# EAGLE design Single_Board (EAGLE 9.5.2)
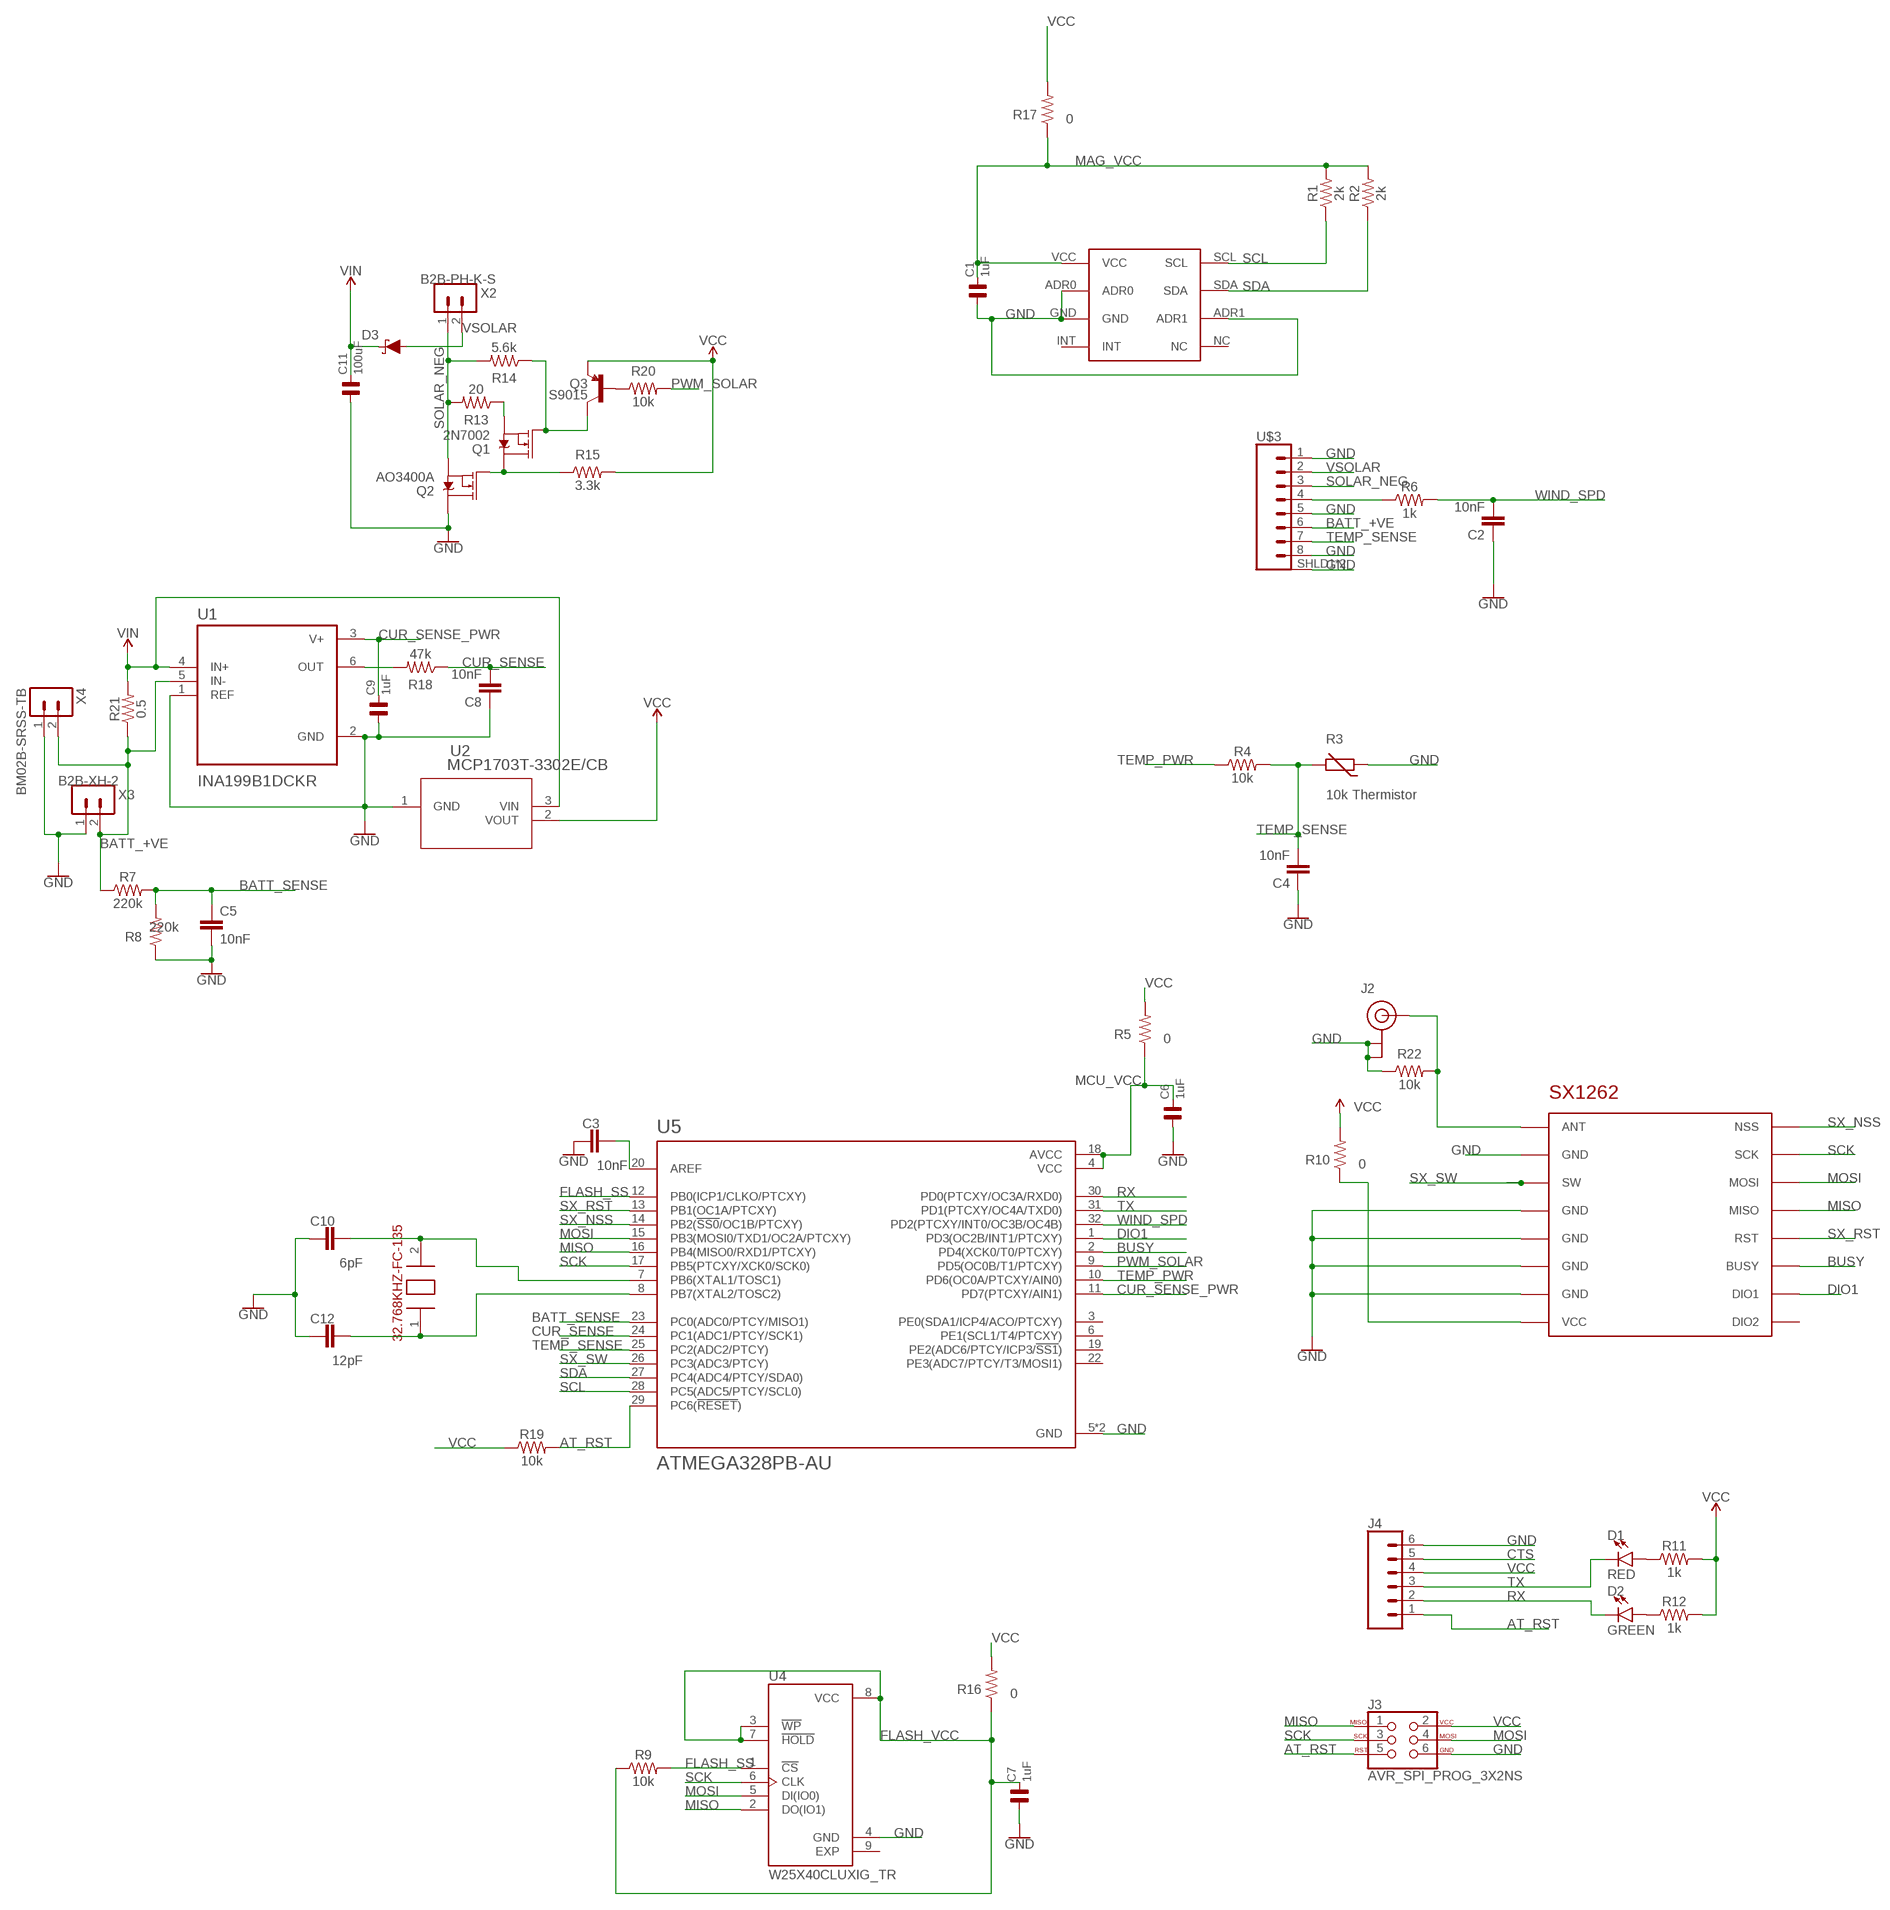
[diagram p0: schematic, sheet 1]

## Parts
C1  1uF  C0805  [0805]
C2  10nF  10NF-0603-50V-10%  [0603]
C3  10nF  10NF-0603-50V-10%  [0603]
C4  10nF  10NF-0603-50V-10%  [0603]
C5  10nF  10NF-0603-50V-10%  [0603]
C6  1uF  C0805  [0805]
C7  1uF  C0805  [0805]
C8  10nF  10NF-0603-50V-10%  [0603]
C9  1uF  C0805  [0805]
C10  6pF  10NF-0603-50V-10%  [0603]
C11  100uF  C1206  [1206]
C12  12pF  10NF-0603-50V-10%  [0603]
D1  RED  LED-RED1206  [LED-1206]
D2  GREEN  LED-GREEN1206  [LED-1206]
D3  NSR0240HT1G  DIODE-SCHOTTKY-PMEG4005EJ  [SOD-323]
J2  U.FL  [U.FL]
J3  AVR_SPI_PROG_3X2NS  [2X3-NS]
J4  CONN_06NO_SILK_FEMALE_PTH  [1X06_NO_SILK]
Q1  2N7002  MOSFET-NCH-BSS138  [SOT23-3]
Q2  AO3400A  MOSFET-NCH-BSS138  [SOT23-3]
Q3  S9015  TRANS_PNP-MMBT4403  [SOT23-3]
R1  2k  RESISTOR0805  [0805]
R2  2k  RESISTOR0805  [0805]
R3  10k Thermistor  THERMISTOR-5  [R-5]
R4  10k  RESISTOR0805  [0805]
R5  0  RESISTOR0805  [0805]
R6  1k  RESISTOR0805  [0805]
R7  220k  RESISTOR0805  [0805]
R8  220k  RESISTOR0805  [0805]
R9  10k  RESISTOR0805  [0805]
R10  0  RESISTOR0805  [0805]
R11  1k  RESISTOR0805  [0805]
R12  1k  RESISTOR0805  [0805]
R13  20  RESISTOR0805  [0805]
R14  5.6k  RESISTOR0805  [0805]
R15  3.3k  RESISTOR0805  [0805]
R16  0  RESISTOR0805  [0805]
R17  0  RESISTOR0805  [0805]
R18  47k  RESISTOR0805  [0805]
R19  10k  RESISTOR0805  [0805]
R20  10k  RESISTOR0805  [0805]
R21  0.5  RESISTOR1206  [1206]
R22  10k  RESISTOR0805  [0805]
U1  INA199B1DCKR  INA199A3DCKR  [SOT65P210X110-6N]
U2  MCP1703T-3302E/CB  [SOT-23A_MC]
U4  W25X40CLUXIG_TR  [PSON50P300X200X60-9N]
U5  ATMEGA328PB-AU  [QFP80P900X900X120-32N]
U$1  ALS31313  [ALS31313-500]
U$2  SX1262  [SX1262]
U$3  RJSHE3380  [RJHSE-3380]
X1  32.768KHZ-FC-135  [32.768KHZ-FC-135]
X2  B2B-PH-K-S  [B2B-PH-K-S]
X3  B2B-XH-2  [B2B-XH-A]
X4  BM02B-SRSS-TB  [BM02B-SRSS-TB]

## Nets
ANT: J2.FEED(SIGNAL) R22.2 U$2.ANT
AT_RST: J3.5 J4.1 R19.2 U5.29(PC6(!RESET!))
BATT_+VE: R7.1 R21.1 U1.5(IN-) U$3.6 X3.2 X4.2
BATT_SENSE: C5.1 R7.2 R8.2 U5.23(PC0(ADC0/PTCY/MISO1))
BUSY: U5.2(PD4(XCK0/T0/PTCXY)) U$2.BUSY
CTS: J4.5
CUR_SENSE: C8.2 R18.1 U5.24(PC1(ADC1/PTCY/SCK1))
CUR_SENSE_PWR: C9.2 U1.3(V+) U5.11(PD7(PTCXY/AIN1))
DIO1: U5.1(PD3(OC2B/INT1/PTCXY)) U$2.DIO1
FLASH_SS: R9.2 U4.1(!CS) U5.12(PB0(ICP1/CLKO/PTCXY))
FLASH_VCC: C7.2 R9.1 R16.1 U4.3(!WP) U4.7(!HOLD) U4.8(VCC)
GND: C1.1 C2.1 C3.1 C4.1 C5.2 C6.1 C7.1 C8.1 C9.1 C10.1 C11.1 C12.1 J2.1(GND) J2.2(GND) J3.6 J4.6 Q2.3(D) R3.1 R8.1 R22.1 U1.1(REF) U1.2(GND) U2.1(GND) U4.4(GND) U5.5(GND) U5.21(GND) U$1.ADR0 U$1.ADR1 U$1.GND U$2.GND@1(GND) U$2.GND@2(GND) U$2.GND@3(GND) U$2.GND@4(GND) U$2.GND@5(GND) U$3.1 U$3.5 U$3.8 U$3.SHLD1(SHLD) U$3.SHLD2(SHLD) X3.1 X4.1
MAG_VCC: C1.2 R1.2 R2.2 R17.1 U$1.VCC
MCU_VCC: C6.2 R5.1 U5.4(VCC) U5.18(AVCC)
MISO: J3.1 U4.2(DO(IO1)) U5.16(PB4(MISO0/RXD1/PTCXY)) U$2.MISO
MOSI: J3.4 U4.5(DI(IO0)) U5.15(PB3(MOSI0/TXD1/OC2A/PTCXY)) U$2.MOSI
N$1: R10.1 U$2.VCC
N$2: C3.2 U5.20(AREF)
N$3: Q1.2(S) R13.1
N$4: D1.A R11.1
N$5: R18.2 U1.6(OUT)
N$6: D2.A R12.1
N$7: C10.2 U5.7(PB6(XTAL1/TOSC1)) X1.2(2.XIN)
N$8: C12.2 U5.8(PB7(XTAL2/TOSC2)) X1.1(1.XIN)
N$9: Q3.1(B) R20.1
N$10: Q1.3(D) Q2.1(G) R15.1
N$11: Q1.1(G) Q3.3(C) R14.1
N$16: R6.1 U$3.4
PWM_SOLAR: R20.2 U5.9(PD5(OC0B/T1/PTCXY))
RX: D2.C J4.2 U5.30(PD0(PTCXY/OC3A/RXD0))
SCK: J3.3 U4.6(CLK) U5.17(PB5(PTCXY/XCK0/SCK0)) U$2.SCK
SCL: R1.1 U5.28(PC5(ADC5/PTCY/SCL0)) U$1.SCL
SDA: R2.1 U5.27(PC4(ADC4/PTCY/SDA0)) U$1.SDA
SOLAR_NEG: Q2.2(S) R13.2 R14.2 U$3.3 X2.1
SX_NSS: U5.14(PB2(!SS0!/OC1B/PTCXY)) U$2.NSS
SX_RST: U5.13(PB1(OC1A/PTCXY)) U$2.RST
SX_SW: U5.26(PC3(ADC3/PTCY)) U$2.SW
TEMP_PWR: R4.1 U5.10(PD6(OC0A/PTCXY/AIN0))
TEMP_SENSE: C4.2 R3.2 R4.2 U5.25(PC2(ADC2/PTCY)) U$3.7
TX: D1.C J4.3 U5.31(PD1(PTCXY/OC4A/TXD0))
VCC: J3.2 J4.4 Q3.2(E) R5.2 R10.2 R11.2 R12.2 R15.2 R16.2 R17.2 R19.1 U2.2(VOUT)
VIN: C11.2 D3.C R21.2 U1.4(IN+) U2.3(VIN)
VSOLAR: D3.A U$3.2 X2.2
WIND_SPD: C2.2 R6.2 U5.32(PD2(PTCXY/INT0/OC3B/OC4B))
Unconnected: U5.3(PE0(SDA1/ICP4/ACO/PTCXY)) U5.6(PE1(SCL1/T4/PTCXY)) U5.19(PE2(ADC6/PTCY/ICP3/!SS1!)) U5.22(PE3(ADC7/PTCY/T3/MOSI1)) U$1.INT U$1.NC U$2.DIO2

## Power pins joined to a net without a drawn wire
EXP: U4.9(EXP)

## Library data of the parts
C1 C6 C7 C9 = capsmd:C0805
C2-C5 C8 = SparkFun-Capacitors:10NF: 0.01uF/10nF/10,000pF ceramic capacitors A capacitor is a passive two-terminal electrical component used to store electrical energy temporarily in an electric field. CAP-09321; PROD_ID: CAP-00867
C10 C12 = SparkFun-Capacitors:10NF: 0.01uF/10nF/10,000pF ceramic capacitors A capacitor is a passive two-terminal electrical component used to store electrical energy temporarily in an electric field. CAP-09321; PROD_ID: CAP-00867; VALUE: 10nF
C11 = capsmd:C1206
D1 = SparkFun-LED:LED-RED: Red SMD LED Used in manufacturing of most products at SparkFun Packages: 0603 - SMD 0603 package [Product Link] <http://docs.avagotech.com/docs/AV02-0551EN> 0603 SMART - SMD 0603 SMART package ( more efficient and expensive)[Product Link] <http://www.osram-os.com/Graphics/XPic2/00077099_0.pdf> 1206 - SMD1206 package [Product Link] <https://www.sparkfun.com/datasheets/DevTools/LilyPad/Q150OVS4.pdff> SparkFun Products: Pro Mini 328 -5V <https://www.sparkfun.com/products/821> RedBoard <https://www.sparkfun.com/products/12757> IOIO-OTG <https://www.sparkfun.com/products/13613>; PROD_ID: DIO-09912
D2 = SparkFun-LED:LED-GREEN: Green SMD LED Used in manufacturing of various products at SparkFun Packages: 0603 - SMD 0603 package [Product Link] <http://www.futureelectronics.com/en/technologies/semiconductors/optoelectronics/leds/Pages/9894312-LTST-C190GKT.aspx?CrossPart=HSMG-C190&IM=0> LilyPad 1206 - SMD1206 LilyPad package [Product Link] <http://www.futureelectronics.com/en/Technologies/Product.aspx?ProductID=IN150NGHARVATEKCORPORATION2049943&IM=0> 1206 - SMD1206 package [Product Link] <http://www.futureelectronics.com/en/technologies/semiconductors/optoelectronics/leds/Pages/8315665-LTST-C150KGKT.aspx?IM=0> 1206 Bottom Mount -SMD 1206 Bottom Mount [Product Link] <http://www.digikey.com/product-detail/en/lite-on-inc/LTST-C230KGKT/160-1456-1-ND/386854> SparkFun Products: Pro Mini 328 -5V <https://www.sparkfun.com/products/821> RedBoard <https://www.sparkfun.com/products/12757> MP3 Trigger <https://www.sparkfun.com/products/13720> Makey Makey <https://www.sparkfun.com/products/11076>; PROD_ID: DIO-00862
D3 = SparkFun-DiscreteSemi:DIODE-SCHOTTKY: Schottky diode A Schottky diode is a semiconductor diode which has a low forward voltage drop and a very fast switching action.; PROD_ID: DIO-10955; VALUE: 0.5A/40V/420mV
J2 = main_board:U.FL: SMD Antenna Connector - U.FL 2mm height, 3.0mm x 3.0mm receptacle size. SparkFun Products: SparkFun WiFi Shield - ESP8266 <https://www.sparkfun.com/products/13287> SparkFun ESP8266 Thing <https://www.sparkfun.com/products/13231> SparkFun MiniGen - Pro Mini Signal Generator Shield <https://www.sparkfun.com/products/11420>; PROD_ID: CONN-09193; SF_ID: WRL-09144
J3 = main_board:AVR_SPI_PROG_3X2: AVR ISP 6 Pin This is the reduced ISP connector for AVR programming. Common on Arduino. This footprint will take up less PCB space and can be used with a 10-pin to 6-pin adapter such as SKU: BOB-08508 **Special note about "TEST_POINT" package. The stop mask is on the top side, so if you want your programming test points to be on the bottom of your board, make sure to place this package on the bottom side of the board. This also ensure that the orientation to program from the bottom side will be correct. SparkFun Products: SparkFun ISP Pogo Adapter <https://www.sparkfun.com/products/11591> - NS Tiny AVR Programmer <https://www.sparkfun.com/products/11801> -PTH
J4 = SparkFun-Connectors:CONN_06: Multi connection point. Often used as Generic Header-pin footprint for 0.1 inch spaced/style header connections On any of the 0.1 inch spaced packages, you can populate with these: Break Away Headers - Straight <https://www.sparkfun.com/products/116> (PRT-00116) Break Away Male Headers - Right Angle <https://www.sparkfun.com/products/553> (PRT-00553) Female Headers <https://www.sparkfun.com/products/115> (PRT-00115) Break Away Headers - Machine Pin <https://www.sparkfun.com/products/117> (PRT-00117) Break Away Female Headers - Swiss Machine Pin <https://www.sparkfun.com/products/743> (PRT-00743) Arduino Stackable Header - 6 Pin <https://www.sparkfun.com/products/9280> (PRT-09280) For SCREWTERMINALS and SPRING TERMINALS visit here: Screw Terimnals on SparkFun.com <https://www.sparkfun.com/search/results?term=Screw+Terminals> (5mm/3.5mm/2.54mm spacing) This device is also useful as a general connection point to wire up your design to another part of your project. Our various solder wires solder well into these plated through hole pads. Hook-Up Wire - Assortment (Stranded, 22 AWG) <https://www.sparkfun.com/products/11375> (PRT-11375) Hook-Up Wire - Assortment (Solid Core, 22 AWG) <https://www.sparkfun.com/products/11367> (PRT-11367) View the entire wire category on our website here <https://www.sparkfun.com/categories/141>; PROD_ID: CONN-08437
Q1 Q2 = SparkFun-DiscreteSemi:MOSFET-NCH: N-channel MOSFETs Voltage controlled devices that allow control of high current outputs. SparkFun Products: SparkFun OpenScale <https://www.sparkfun.com/products/13261> SparkFun Digital Sandbox <https://www.sparkfun.com/products/12651> SparkFun Monster Moto Shield <https://www.sparkfun.com/products/10182> SparkFun MOSFET Power Controller <https://www.sparkfun.com/products/11214>; PROD_ID: TRANS-00830; VALUE: 220mA/50V/3.5Ω
Q3 = SparkFun-DiscreteSemi:TRANS_PNP: PNP transistor Current controlled devices typically used to amplify current or used as a switch. SparkFun Products: SparkFun Serial Enabled 16x2 LCD - Red on Black <https://www.sparkfun.com/products/9068> SparkFun Logomatic <https://www.sparkfun.com/products/12772>; PROD_ID: TRANS-09245; VALUE: 600mA/40V
R1 R2 R4-R22 = SparkFun-Resistors:RESISTOR: Generic Resistor Package
R3 = varistor:THERMISTOR: THERMISTOR
U1 = main_board:INA199A3DCKR; DESCRIPTION: 26V, bi-directional current sense amplifier 6-SC70 -40 to 125; DIGI-KEY_PART_NUMBER: 296-27333-1-ND; MF: Texas Instruments; MP: INA199A3DCKR; PACKAGE: SOT-SC70-6 Texas Instruments; PURCHASE-URL: https://pricing.snapeda.com/search/part/INA199A3DCKR/?ref=eda
U2 = my-components:MCP1703T-3302E/CB; BUILT_BY: EMA_UL_Team; MANUFACTURER_PART_NUMBER: MCP1703T-3302E/CB; VENDOR: Microchip
U4 = main_board:W25X40CLUXIG_TR: Spiflash, 4m-Bit, 4kb Uniform Se; DESCRIPTION: FLASH Memory IC 4Mb (512K x 8) SPI 104MHz 8-USON (2x3); DIGI-KEY_PART_NUMBER: W25X40CLUXIGCT-ND; MF: Winbond Electronics; MP: W25X40CLUXIG TR; PACKAGE: UFDFN-8 Winbond; PURCHASE-URL: https://pricing.snapeda.com/search/part/W25X40CLUXIG TR/?ref=eda
U5 = main_board:ATMEGA328PB-AU: ATmega Series 20 MHz 32 KB Flash 2 KB SRAM 8-Bit Microcontroller - TQFP-32; AVAILABILITY: Unavailable; DESCRIPTION: AVR AVR® ATmega Microcontroller IC 8-Bit 20MHz 32KB _16K x 16_ FLASH 32-TQFP _7x7_; MF: Microchip Technology; MP: ATMEGA328PB-AU; PACKAGE: TQFP-32 Microchip Technology; PRICE: None
U$1 = main_board:ALS31313
U$2 = RadioShield:SX1262
U$3 = main_board:RJSHE3380
X1 = main_board:32.768KHZ-FC-135
X2 = con-JST PH:B2B-PH: JST PH series header 2.00mm pitch disconnectable crimp style connectors, vertical (side entry type), 2 pins
X3 = con-JST XH:B2B-XH: JST XH series header 2.50mm pitch disconnectable crimp style connectors, vertical (side entry type), 2 pins
X4 = main_board:BM02B-SRSS: JST SH series header 1.00mm pitch disconnectable crimp style connectors, vertical (side entry type), 2 pins

## Board
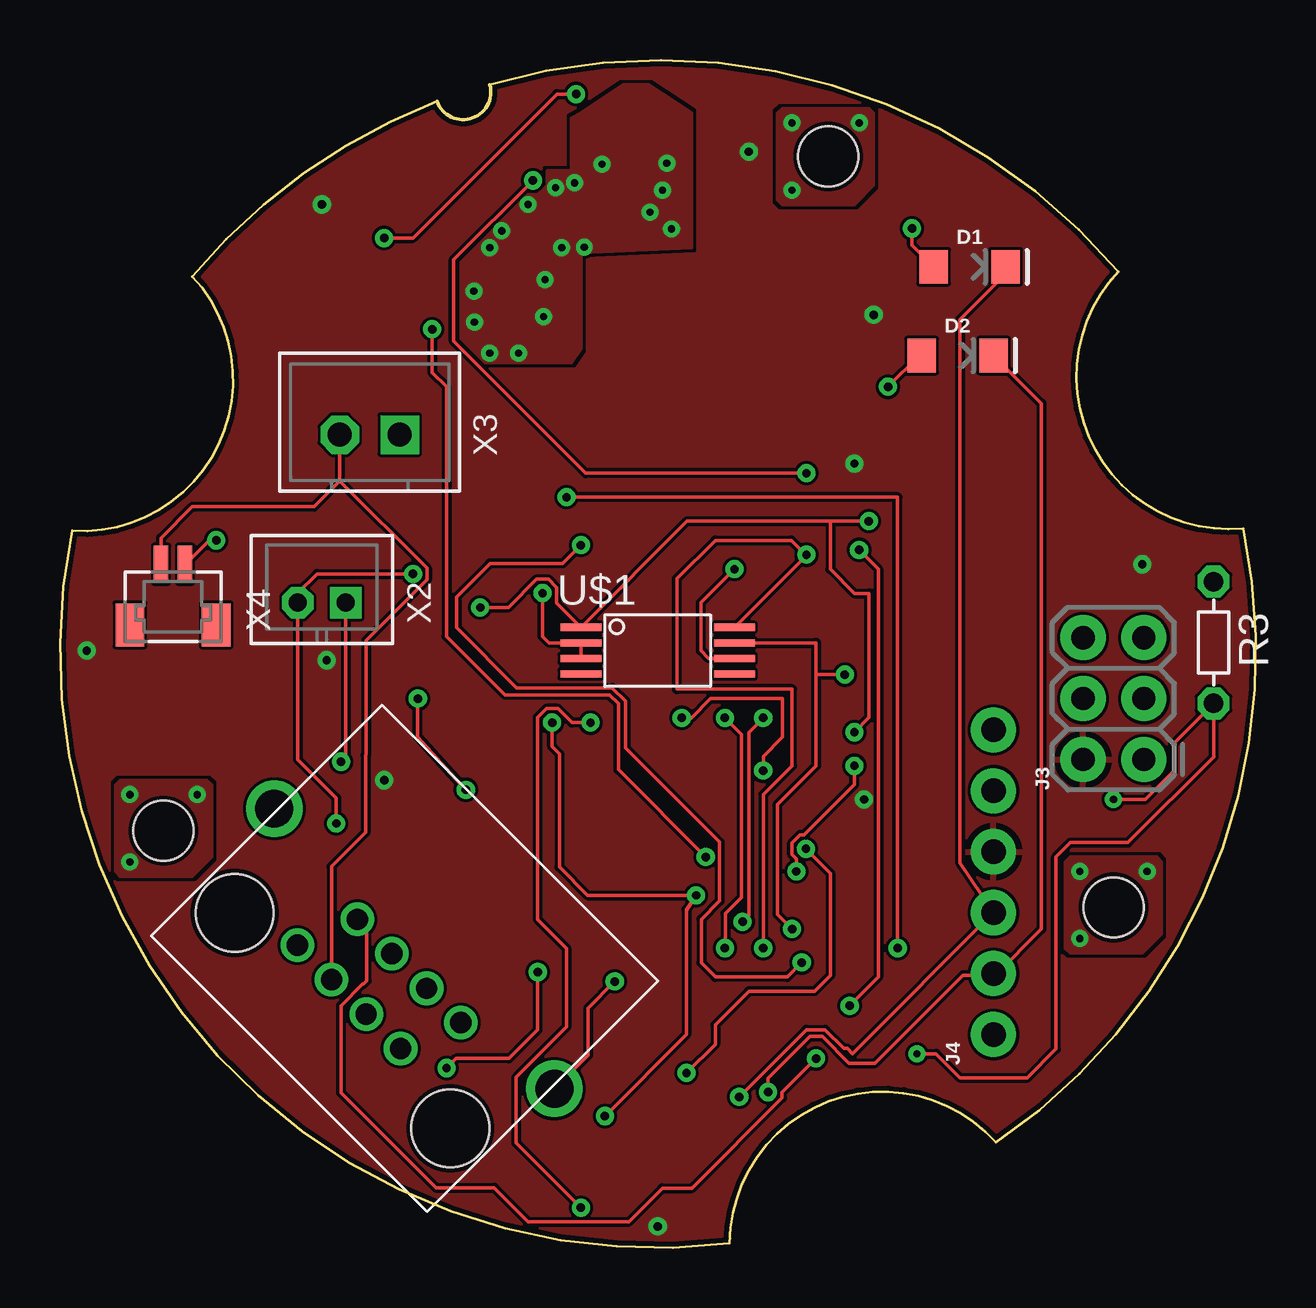
[diagram p1: board, top side]
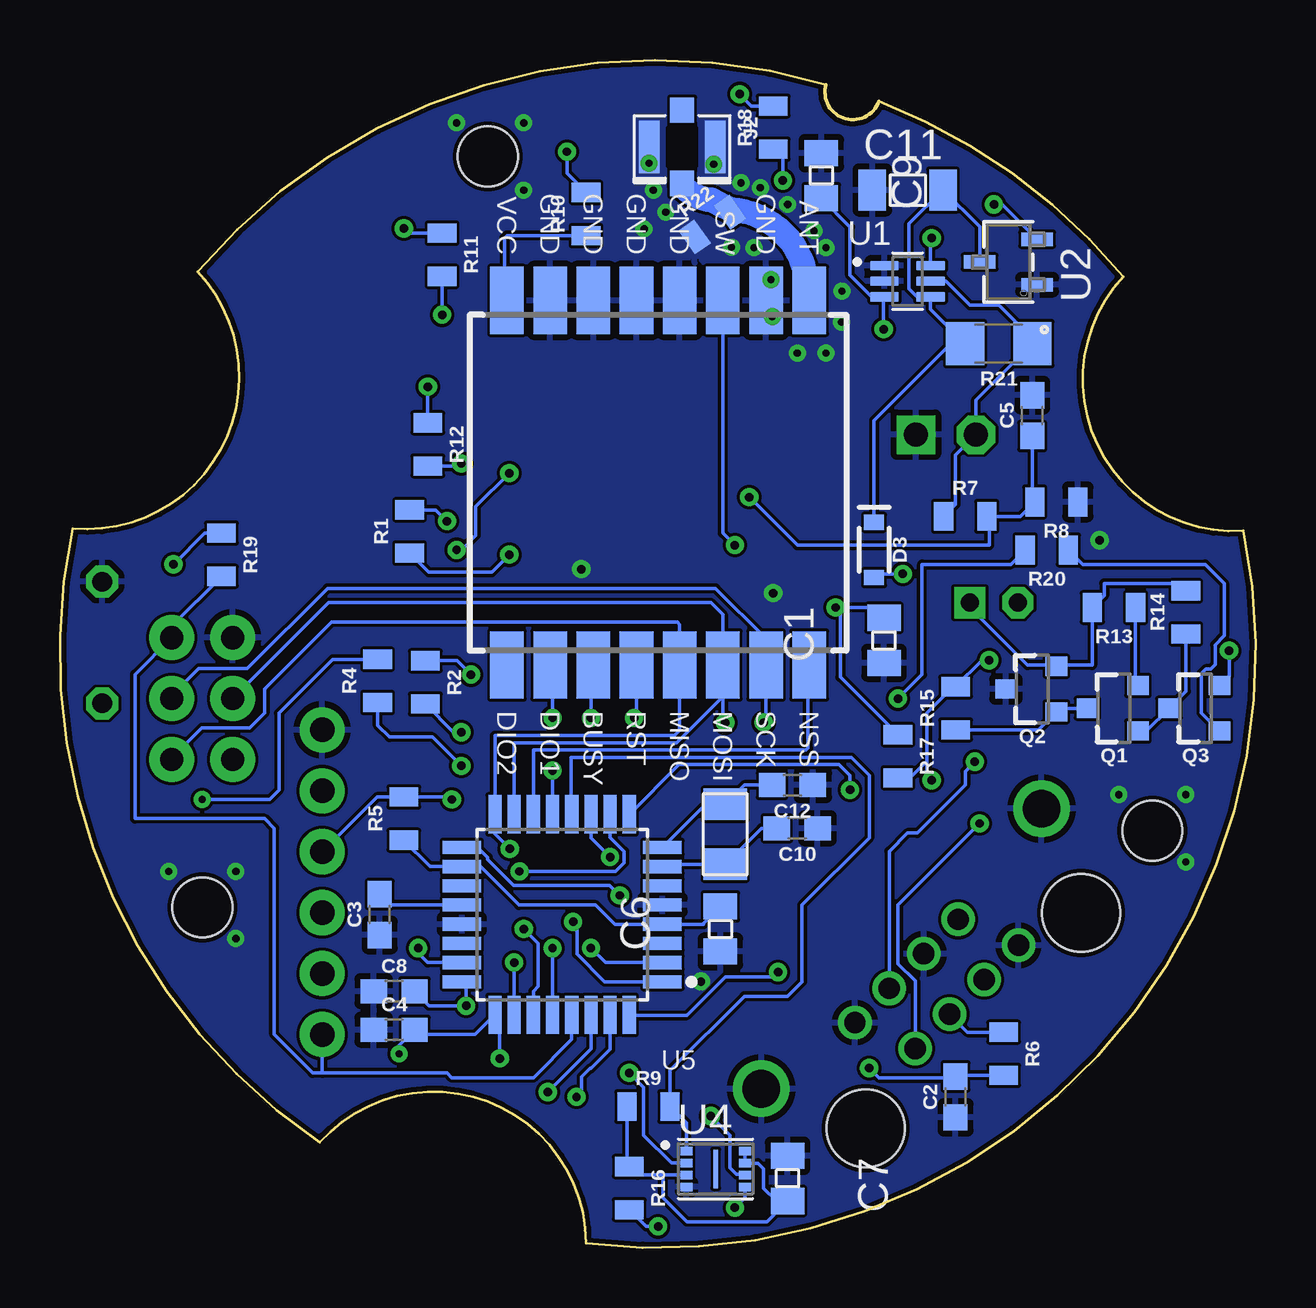
[diagram p2: board, bottom side, seen from below]

Size 49.84 x 49.5 mm. Coordinates in mm from the lower left corner, seen from the top.
Outline: 49.31,29.98 arc-68 39.01,4.38 arc138 27.91,0.18 arc-109 0.51,29.88 arc137 5.51,40.48 arc-29 15.71,47.78 arc176 17.91,48.48 arc-66 44.11,40.68 arc139 49.31,29.98
Copper layers (1*16): Top 0.035mm / dielectric 1.5mm / Bottom 0.035mm
Design rules "default *": minimum track width 6mil, minimum drill 0.3mm, track to track 5mil, track to pad 0.2mm, pad to pad 5mil, via to via 6mil, smd to smd 0mil, copper to edge 0.2mm, drill to drill 10mil, minimum pad ring 10mil, minimum via ring 8mil, stop-mask expansion 4mil, vias tented up to drill 0mil, thermal gap 10mil
Holes 2.5 mm at 4.31,17.38 32.01,45.48 43.91,14.18
bRestrict: area 23.3,45.1 to 24.5,46.7

### Footprints (pad centres in the part's own frame; a part is rotated, then mirrored left to right if it is on the bottom)
0805 = smd 1.092 x 1.397: 1 -0.94,0; 2 0.94,0
0603 = smd 1.1 x 1: 1 -0.85,0; 2 0.85,0
1206 = smd 1.143 x 1.702: 1 -1.473,0; 2 1.473,0
LED-1206 = smd 1.2 x 1.4: A -1.5,0; C 1.5,0
SOD-323 = smd 0.63 x 0.83: A 1.15,0; C -1.15,0
U.FL = smd 2.2 x 0.85: 1 0,1.375; 2 0,-1.375 | smd 1.05 x 1: FEED 1.525,0; NC -1.525,0
2X3-NS = drill 0.965 pad 1.88: 1 -2.54,-1.27; 2 -2.54,1.27; 3 0,-1.27; 4 0,1.27; 5 2.54,-1.27; 6 2.54,1.27
1X06_NO_SILK = drill 1.016 pad 1.88: 1 0,0; 2 2.54,0; 3 5.08,0; 4 7.62,0; 5 10.16,0; 6 12.7,0
SOT23-3 = smd 0.8 x 0.9: 1 -0.95,-1; 2 0.95,-1; 3 0,1.1
0805' = smd 0.8 x 1.2: 1 -0.9,0; 2 0.9,0
R-5 = drill 0.813 octagon: 1 -2.54,0; 2 2.54,0
1206' = smd 1.6 x 1.8: 1 -1.4,0; 2 1.4,0
SOT65P210X110-6N = smd 1.19 x 0.4: 1 -0.96,0.65; 2 -0.96,0; 3 -0.96,-0.65; 4 0.96,-0.65; 5 0.96,0; 6 0.96,0.65
SOT-23A_MC = smd 0.559 x 1.321: 1 -0.95,-1.195; 2 0.95,-1.195; 3 0,1.195
PSON50P300X200X60-9N = smd 0.49 x 0.35: 1 -1.22,0.75; 2 -1.22,0.25; 3 -1.22,-0.25; 4 -1.22,-0.75; 5 1.22,-0.75; 6 1.22,-0.25; 7 1.22,0.25; 8 1.22,0.75 | smd 0.2 x 1.6: 9 0,0
QFP80P900X900X120-32N = smd 1.6 x 0.55: 1 -4.18,2.8; 2 -4.18,2; 3 -4.18,1.2; 4 -4.18,0.4; 5 -4.18,-0.4; 6 -4.18,-1.2; 7 -4.18,-2; 8 -4.18,-2.8; 17 4.18,-2.8; 18 4.18,-2; 19 4.18,-1.2; 20 4.18,-0.4; 21 4.18,0.4; 22 4.18,1.2; 23 4.18,2; 24 4.18,2.8 | smd 0.55 x 1.6: 9 -2.8,-4.18; 10 -2,-4.18; 11 -1.2,-4.18; 12 -0.4,-4.18; 13 0.4,-4.18; 14 1.2,-4.18; 15 2,-4.18; 16 2.8,-4.18; 25 2.8,4.18; 26 2,4.18; 27 1.2,4.18; 28 0.4,4.18; 29 -0.4,4.18; 30 -1.2,4.18; 31 -2,4.18; 32 -2.8,4.18
ALS31313-500 = smd 1.7 x 0.3: ADR0 -3.2,0.325; ADR1 3.2,-0.325; GND -3.2,-0.325; INT -3.2,-0.975; NC 3.2,-0.975; SCL 3.2,0.975; SDA 3.2,0.325; VCC -3.2,0.975
SX1262 = smd 2.8 x 1.4: ANT -7.6,6.3; BUSY 7.6,-2.7; DIO1 7.6,-4.5; DIO2 7.6,-6.3; GND@1 -7.6,4.5; GND@2 -7.6,0.9; GND@3 -7.6,-0.9; GND@4 -7.6,-2.7; GND@5 -7.6,-4.5; MISO 7.6,0.9; MOSI 7.6,2.7; NSS 7.6,6.3; RST 7.6,-0.9; SCK 7.6,4.5; SW -7.6,2.7; VCC -7.6,-6.3
RJHSE-3380 = drill 0.89 pad 1.27: 1 3.55,0.94; 2 2.54,-1.6; 3 1.53,0.94; 4 0.51,-1.6; 5 -0.51,0.94; 6 -1.53,-1.6; 7 -2.54,0.94; 8 -3.55,-1.6 | drill 1.57 pad 2: SHLD1 -8.26,1.75; SHLD2 8.26,1.75 | hole 3.25: -6.35,-2.49; 6.35,-2.49
32.768KHZ-FC-135 = smd 1.3 x 1.8: 1 0,0; 2 2.5,0
B2B-PH-K-S = drill 0.75 pad 1.3 square: 1 1,0 | drill 0.75 pad 1.3 octagon: 2 -1,0
B2B-XH-A = drill 1 pad 1.6 square: 1 1.25,0 | drill 1 pad 1.6 octagon: 2 -1.25,0
BM02B-SRSS-TB = smd 0.6 x 1.55: 1 0.5,0; 2 -0.5,0 | smd 1.2 x 1.8: M1 1.8,-2.525; M2 -1.8,-2.525

### Placement (x,y rotation side)
C1  15.49,25.31 90 bottom
C2  12.51,6.28 90 bottom
C3  36.51,13.88 90 bottom
C4  35.91,9.08 0 bottom
C5  9.31,34.68 90 bottom
C6  22.31,13.28 90 bottom
C7  19.51,2.88 270 bottom
C8  35.91,10.68 0 bottom
C9  18.11,44.68 270 bottom
C10  19.11,17.48 180 bottom
C11  14.51,44.08 0 bottom
C12  19.31,19.28 180 bottom
D1  37.91,40.88 0 top
D2  37.41,37.18 0 top
D3  15.91,29.08 270 bottom
J2  23.91,45.88 270 bottom
J3  43.91,22.88 90 top
J4  38.91,8.88 90 top
Q1  5.91,22.48 90 bottom
Q2  9.31,23.28 90 bottom
Q3  2.51,22.48 90 bottom
R1  2k  [0805']  35.27,29.85 90 bottom
R2  2k  [0805']  34.61,23.56 270 bottom
R3  48.08,25.22 270 top
R4  10k  [0805']  36.6,23.62 90 bottom
R5  0  [0805']  35.51,17.88 90 bottom
R6  1k  [0805']  10.51,8.08 270 bottom
R7  220k  [0805']  12.11,30.48 0 bottom
R8  220k  [0805']  8.31,31.08 180 bottom
R9  10k  [0805']  25.31,5.88 0 bottom
R10  0  [0805']  27.91,43.08 90 bottom
R11  1k  [0805']  33.91,41.38 270 bottom
R12  1k  [0805']  34.51,33.48 270 bottom
R13  20  [0805']  5.91,26.68 180 bottom
R14  5.6k  [0805']  2.91,26.48 90 bottom
R15  3.3k  [0805']  12.51,22.48 90 bottom
R16  0  [0805']  26.11,2.48 270 bottom
R17  0  [0805']  14.91,20.48 270 bottom
R18  47k  [0805']  20.11,46.68 90 bottom
R19  10k  [0805']  43.11,28.88 270 bottom
R20  10k  [0805']  8.71,29.08 180 bottom
R21  0.5  [1206']  10.71,37.68 180 bottom
R22  10k  [0805']  22.65,42.64 35 bottom
U1  14.51,40.28 0 bottom
U2  10.31,41.08 90 bottom
U4  22.51,3.28 0 bottom
U5  28.91,13.88 180 bottom
U$1  24.91,24.88 0 top
U$2  24.91,31.88 270 bottom
U$3  13.53,11.22 315 top
X1  22.11,18.48 270 bottom
X2  10.91,26.88 0 top
X3  12.91,33.88 0 top
X4  4.71,28.48 0 top

### Tracks (layer width: path | path; a pad name or v marks a point on that pad's centre or on a via)
ANT
  Bottom 0.152: J2.FEED 23.91,44.28 R22.2
  Bottom 0.305: U$2.ANT 18.71,40.28
  Bottom 1.016: 18.71,40.28 arc-79 21.91,43.28 22.27,43.46 22.69,43.67 arc46 23.91,44.28
AT_RST
  Bottom 0.152: U5.29 28.51,8.68 30.11,7.08 33.51,7.08 33.71,7.28 38.91,7.28 | 38.91,7.28 39.31,7.28 40.91,8.88 40.91,17.48 41.31,17.88 46.71,17.88 46.71,23.89 J3.5 45.18,25.91 R19.2 | J4.1 38.91,7.28
BATT_+VE
  Top 0.152: X3.2 11.66,31.95 | 11.66,31.95 15.29,28.32 15.29,27.84 12.77,25.31 12.77,20.55 12.73,20.52 12.73,17.3 11.31,15.88 U$3.6 | X4.2 4.21,29.58 5.51,30.88 10.59,30.88 11.66,31.95
  Bottom 0.152: R7.1 12.51,30.98 12.51,33.03 X3.2 11.66,35.33 R21.1 9.31,37.88 10.71,39.28 11.91,39.28 12.91,40.28 U1.5
BATT_SENSE  (via drill 0.35)
  Top 0.152: v21.11,31.28 34.91,31.28 v34.91,12.48
  Bottom 0.152: U5.23 34.51,11.88 34.91,12.28 v34.91,12.48 | R7.2 11.11,30.48 | 11.11,30.48 9.81,30.48 9.26,31.03 | 9.26,31.03 R8.2 | C5.1 9.31,31.08 9.26,31.03 | v21.11,31.28 19.11,29.28 11.11,29.28 11.11,30.48
BUSY  (via drill 0.35)
  Top 0.152: v27.71,22.08 28.4,21.39 28.4,14.59 27.73,13.92 27.73,12.5 v27.71,12.48
  Bottom 0.152: U5.2 27.11,11.88 v27.71,12.48 | v27.71,22.08 27.71,24.18 U$2.BUSY
CUR_SENSE  (via drill 0.35)
  Top 0.152: v31.11,32.28 21.91,32.28 16.41,37.78 16.41,41.18 v19.71,44.48 | v33.31,29.08 34.11,28.28 34.11,11.28 v32.91,10.08
  Bottom 0.152: v31.11,32.28 32.51,30.88 32.51,29.68 33.11,29.08 v33.31,29.08 | U5.24 32.91,10.9 v32.91,10.08 34.46,10.08 C8.2 | v19.71,44.48 19.71,45.38 R18.1
CUR_SENSE_PWR  (via drill 0.35)
  Top 0.152: v26.91,16.28 23.27,19.92 23.27,22.68 22.91,23.04 18.55,23.04 16.11,25.48 16.11,35.88 15.51,36.48 v15.51,38.28
  Bottom 0.152: U5.11 27.71,17.08 v26.91,16.28 | v15.51,38.28 15.51,39.59 U1.3 16.02,39.64 16.91,40.53 16.91,42.54 C9.2
DIO1  (via drill 0.35)
  Top 0.152: v28.45,13.58 28.71,13.84 28.71,21.48 v29.31,22.08
  Bottom 0.152: v28.45,13.58 28.29,13.42 28.29,12.24 27.14,11.08 U5.1 | v29.31,22.08 29.31,24.18 U$2.DIO1
FLASH_SS
  Bottom 0.152: U5.12 28.53,18.08 28.53,20.42 16.85,20.42 16.11,19.68 16.11,17.08 18.91,14.28 18.91,11.08 19.51,10.48 21.31,10.48 24.41,7.38 R9.2 23.73,5.2 U4.1
FLASH_VCC
  Bottom 0.152: U4.3 24.71,3.03 | 24.71,3.03 25.76,3.03 R16.1 26.21,3.48 R9.1 | 24.71,3.03 24.71,2.08 23.71,1.08 20.37,1.08 C7.2 19.97,1.94 20.51,2.48 20.51,3.28 20.75,3.52 U4.7 U4.8
GND  (via drill 0.3, 0.35)
  Top 0.152: U$1.GND U$1.ADR0 20.39,25.2 20.11,25.48 v20.11,27.28 | U$1.ADR1 27.04,24.55 26.71,24.88 26.71,26.88 v28.11,28.28 | X4.1 6.21,29.48 v6.51,29.48 | U$3.SHLD2 22.01,8.02 22.01,9.98 v23.12,11.09
  other vias: 2.91,18.88 2.91,16.08 5.71,18.88 30.51,44.08 30.51,46.88 33.31,46.88 42.51,15.68 42.51,12.88 45.31,15.68 20.65,44.18 20.91,41.68 21.85,41.7 19.51,43.48 17.91,41.68 19.11,37.28 17.91,37.28 25.11,44.08 17.25,39.86 17.27,38.58 18.41,42.38 25.49,42.46 21.45,44.38 22.59,45.16 25.29,45.2 20.21,40.34 20.15,38.8 24.59,43.16
  pour Bottom: -0.09,-0.12 -0.09,49.88 49.91,49.88 49.91,-0.12
  pour Top (isolate 0.1): 2.51,19.48 6.11,19.48 6.31,19.28 6.31,16.28 5.51,15.48 2.51,15.48 2.31,15.68 2.31,19.28
  pour Top: 30.11,47.48 33.71,47.48 33.91,47.28 33.91,44.28 33.11,43.48 30.11,43.48 29.91,43.68 29.91,47.28
  pour Top: 42.11,16.28 45.71,16.28 45.91,16.08 45.91,13.08 45.11,12.28 42.11,12.28 41.91,12.48 41.91,16.08
  pour Top: 21.31,36.88 17.71,36.88 16.71,37.88 16.71,41.08 19.51,43.88 19.91,43.88 20.31,44.28 20.31,44.88 21.31,44.88 21.31,47.08 21.71,47.28 23.51,48.48 24.51,48.48 26.31,47.28 26.31,41.68 21.71,41.48 21.71,37.48
  pour Bottom (rank 2, no thermals): 21.91,47.28 25.91,47.28 25.91,41.28 21.91,41.28
MAG_VCC  (via drill 0.35)
  Top 0.152: v17.51,26.68 18.69,26.68 19.87,27.86 20.35,27.86 20.69,27.52 20.69,26.87 U$1.VCC 26.14,30.28 32.11,30.28 | 32.11,30.28 v33.71,30.28 | v33.11,21.48 33.72,22.09 33.72,27.27 33.12,27.27 32.11,28.28 32.11,30.28
  Bottom 0.152: R2.2 33.43,21.48 v33.11,21.48 | C1.2 15.92,26.68 17.31,26.68 | 17.31,26.68 v17.51,26.68 | R1.2 34.18,30.75 v33.71,30.28 | R17.1 17.31,23.78 17.31,26.68
MCU_VCC
  Bottom 0.152: C6.2 23.01,13.52 23.01,13.48 U5.4 26.71,13.48 27.51,14.28 30.71,14.28 32.31,15.88 U5.18 34.41,15.88 R5.1
MISO  (via drill 0.35)
  Top 0.152: v31.09,16.62 32.11,15.6 32.11,11.34 31.45,10.68 28.71,10.68 27.31,9.28 27.31,8.48 v26.11,7.28
  Bottom 0.152: v31.09,16.62 31.71,17.24 U5.16 31.71,21.34 24.23,21.34 24.01,21.56 U$2.MISO 24.01,25.98 24.11,26.08 38.51,26.08 41.31,23.28 41.31,22.28 41.93,21.66 43.93,21.66 45.18,20.41 J3.1 | v26.11,7.28 25.51,6.68 25.51,4.68 24.36,3.53 U4.2
MOSI  (via drill 0.35)
  Top 0.152: v22.11,21.88 21.34,21.88 20.75,22.46 20.27,22.46 19.91,22.1 19.91,13.68 21.11,12.48 21.11,9.19 19.01,7.09 19.01,4.36 v21.71,1.66
  Bottom 0.152: U5.15 30.91,21.03 24.15,21.03 22.21,22.96 U$2.MOSI | U$2.MOSI 22.21,21.98 v22.11,21.88 | J3.4 38.64,26.88 22.71,26.88 22.21,26.38 U$2.MOSI | v21.71,1.66 21.29,2.08 U4.5
N$1
  Bottom 0.152: U$2.VCC 31.31,39.58 31.31,42.08 31.21,42.18 R10.1
N$2
  Bottom 0.152: C3.2 36.06,14.28 U5.20
N$3
  Bottom 0.152: Q1.2 5.01,23.53 R13.1
N$4  (via drill 0.35)
  Top 0.152: D1.A 35.51,41.78 v35.51,42.48
  Bottom 0.152: v35.51,42.48 35.31,42.28 R11.1
N$5  (via drill 0.35)
  Top 0.152: v13.51,42.08 14.71,42.08 20.71,48.08 v21.51,48.08
  Bottom 0.152: U1.6 13.55,42.04 v13.51,42.08 | v21.51,48.08 21.01,47.58 R18.2
N$6  (via drill 0.35)
  Top 0.152: v34.51,35.88 35.81,37.18 D2.A
  Bottom 0.152: R12.1 v34.51,35.88
N$7
  Bottom 0.152: U5.7 24.71,15.88 24.61,15.98 X1.2 20.61,17.48 C10.2
N$8
  Bottom 0.152: U5.8 22.93,18.48 X1.1 21.31,19.28 C12.2
N$9
  Bottom 0.152: R20.1 7.21,28.48 2.11,28.48 1.31,27.68 1.31,25.5 1.69,25.12 1.69,24.3 1.88,24.11 2.09,24.11 2.27,23.93 2.27,22.28 Q3.1
N$10
  Bottom 0.152: Q1.3 8.16,22.48 Q2.1 9.06,21.58 R15.1
N$11
  Bottom 0.152: R14.1 2.91,23.18 Q3.3 4.56,21.53 Q1.1
N$16
  Bottom 0.152: U$3.4 12.01,8.98 R6.1
PWM_SOLAR  (via drill 0.35)
  Top 0.152: v16.91,19.08 14.91,21.28 v14.91,22.88
  Bottom 0.152: U5.9 24.03,20.14 17.37,20.14 16.91,19.68 v16.91,19.08 | v14.91,22.88 13.91,23.88 13.91,28.48 10.21,28.48 R20.2
RX  (via drill 0.35)
  Top 0.152: 38.84,11.35 J4.2 | D2.C 40.91,35.18 40.91,13.28 38.98,11.35 38.84,11.35 | 38.84,11.35 37.64,11.35 33.97,7.68 32.89,7.68 31.77,8.8 31.25,8.8 29.51,7.06 v29.51,6.48
  Bottom 0.152: v29.51,6.48 27.71,8.28 U5.30
SCK  (via drill 0.35)
  Top 0.152: v20.51,21.88 20.51,20.88 20.81,20.58 20.81,15.86 21.99,14.68 v26.51,14.68 26.11,14.08 26.11,8.88 v22.71,5.48
  Bottom 0.152: v20.51,21.88 20.41,21.98 U$2.SCK 20.41,25.38 22.51,27.48 38.69,27.48 42.03,24.14 44.05,24.14 45.18,23.01 J3.3 | v26.51,14.68 26.93,15.1 30.94,15.1 32.02,16.18 32.02,16.27 32.43,16.68 U5.17 | U4.6 21.32,3.05 21.64,3.05 21.91,3.32 21.91,4.68 v22.71,5.48
SCL  (via drill 0.35)
  Top 0.152: v29.31,12.48 29.31,18.88 30.51,20.08 30.51,23.28 25.71,23.28 25.71,27.88 27.31,29.48 30.49,29.48 31.11,28.85 | U$1.SCL 31.11,28.85 | 31.11,28.85 v31.11,28.88
  Bottom 0.152: U5.28 v29.31,12.48 | R1.1 34.47,28.15 31.84,28.15 v31.11,28.88
SDA  (via drill 0.35)
  Top 0.152: U$1.SDA 31.51,25.2 31.51,23.88 | 31.51,23.88 31.51,20.08 29.91,18.48 29.91,13.88 v30.51,13.28 | 31.51,23.88 v32.71,23.88
  Bottom 0.152: v32.71,23.88 33.29,24.46 R2.1 | U5.27 30.11,10.68 29.91,10.88 29.91,12.68 v30.51,13.28
SOLAR_NEG  (via drill 0.35)
  Top 0.152: X2.1 11.91,20.25 v11.71,20.25
  Bottom 0.152: X2.1 11.91,26.68 9.51,24.28 8.36,24.28 | Q2.2 8.36,24.28 | 8.36,24.28 6.81,24.28 R13.2 6.31,27.18 6.31,27.68 3.21,27.68 R14.2 | v11.71,20.25 12.11,19.85 12.11,19.28 14.11,17.28 14.51,17.28 15.28,16.51 U$3.3
SX_NSS
  Bottom 0.152: U$2.NSS 18.66,24.23 18.66,20.82 18.75,20.73 30.11,20.73 U5.14
SX_RST  (via drill 0.35)
  Top 0.152: v29.31,19.88 29.31,20.48 30.11,21.28 30.11,22.88 27.11,22.88 26.31,22.08 v25.91,22.08
  Bottom 0.152: U5.13 v29.31,19.88 | v25.91,22.08 25.81,22.18 U$2.RST
SX_SW  (via drill 0.35)
  Top 0.152: v21.71,29.28 20.95,28.51 17.93,28.51 16.53,27.12 16.53,25.84 19.04,23.33 23.02,23.33 23.57,22.78 23.57,20.83 27.49,16.9 27.49,14.44 26.73,13.68 26.73,11.87 27.32,11.28 30.31,11.28 v30.91,11.88
  Bottom 0.152: U5.26 v30.91,11.88 | v21.71,29.28 22.21,29.78 U$2.SW
TEMP_PWR  (via drill 0.35)
  Top 0.152: v33.11,20.08 33.11,19.3 31.01,17.2 30.85,17.2 30.51,16.86 30.51,16.38 30.69,16.2 v30.69,15.68
  Bottom 0.152: v30.69,15.68 26.69,15.68 26.33,16.04 26.33,16.52 26.91,17.1 U5.10 | v33.11,20.08 34.31,21.28 36.11,21.28 36.6,21.77 R4.1
TEMP_SENSE  (via drill 0.3, 0.35)
  Top 0.152: v31.51,7.88 30.09,6.46 30.09,6.24 26.34,2.48 25.11,2.48 23.71,1.08 19.51,1.08 18.09,2.5 15.67,2.5 11.71,6.46 11.71,10.08 12.62,10.99 12.65,10.99 12.78,11.12 12.78,13.3 U$3.7 | v35.71,8.08 36.51,8.08 37.51,7.08 40.31,7.08 41.51,8.28 41.51,16.28 42.11,16.88 44.51,16.88 48.08,20.45 R3.2 46.4,21 46.4,19.84 45.24,18.68 v43.91,18.68
  Bottom 0.152: U5.25 31.82,9.59 | 31.82,9.59 32.53,8.88 34.86,8.88 C4.2 35.71,8.43 v35.71,8.08 | v31.51,7.88 31.51,9.28 31.82,9.59 | R4.2 38.47,24.52 40.71,22.28 40.71,19.08 41.11,18.68 v43.91,18.68
TX  (via drill 0.35)
  Top 0.152: D1.C 39.41,40.58 37.51,38.68 37.51,16.03 J4.3 33.03,8.08 32.81,8.3 32.67,8.3 31.89,9.08 31.11,9.08 v28.31,6.28
  Bottom 0.152: U5.31 26.91,8.26 27.71,7.46 27.75,7.46 28.09,7.12 28.09,6.5 v28.31,6.28
VCC  (via drill 0.35)
  Bottom 0.152: 34.21,32.28 R12.2 33.21,32.58 v33.11,32.68 | v33.51,18.68 33.61,18.78 R5.2 36.63,18.78 J4.4 | R10.2 28.71,44.78 v28.71,45.68 | R11.2 v33.91,38.88 | v10.91,43.48 10.57,43.48 U2.2 | Q3.2 1.11,23.83 v1.11,24.88 | v45.11,28.48 43.81,29.78 R19.1 | R16.2 25.41,0.88 v24.91,0.88 | v11.11,24.48 11.41,24.48 R15.2 12.61,23.38 13.71,22.28 13.71,20.28 | 13.71,20.28 14.41,19.58 R17.2 | 13.71,20.28 13.71,19.68 v13.51,19.48
  pour Top (rank 2): -0.09,49.88 49.91,49.88 49.91,-0.12 -0.09,-0.12
VIN
  Bottom 0.152: D3.C 15.91,34.48 12.71,37.68 R21.2 13.55,39.12 U1.4 13.57,39.62 14.1,39.62 14.45,39.96 14.45,42.67 C11.2 11.51,42.55 U2.3
VSOLAR  (via drill 0.35)
  Top 0.152: v14.71,28.08 10.71,28.08 9.91,27.28 X2.2 9.91,20.35 11.51,18.75 v11.51,17.68
  Bottom 0.152: v14.71,28.08 15.76,28.08 D3.A | U$3.2 14.2,11.11 14.92,11.83 14.92,14.27 v11.51,17.68
WIND_SPD  (via drill 0.35)
  Top 0.152: v19.91,11.48 19.91,9.08 18.71,7.88 16.51,7.88 v16.11,7.48
  Bottom 0.152: U5.32 26.09,9.68 23.71,9.68 22.11,11.28 20.11,11.28 v19.91,11.48 | R6.2 12.46,7.18 C2.2 12.56,7.08 15.71,7.08 v16.11,7.48